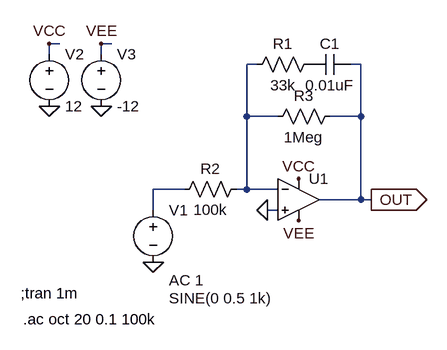
[diagram p0: schematic gaje_pink_noise_filter_01.asc]
gaje_pink_noise_filter_01.asc, the LTspice schematic file:
Version 4
SHEET 1 880 680
WIRE -80 -80 -96 -80
WIRE 0 -80 -16 -80
WIRE -96 -64 -96 -80
WIRE -16 -64 -16 -80
WIRE 224 -48 208 -48
WIRE 384 -48 368 -48
WIRE 208 32 208 -48
WIRE 256 32 208 32
WIRE 384 32 384 -48
WIRE 384 32 336 32
WIRE 112 144 64 144
WIRE 208 144 208 32
WIRE 208 144 192 144
WIRE 256 144 208 144
WIRE 384 160 384 32
WIRE 384 160 320 160
WIRE 400 160 384 160
WIRE 64 176 64 144
WIRE 256 176 240 176
FLAG 288 128 VCC
FLAG 288 192 VEE
FLAG 64 256 0
FLAG 240 176 0
FLAG -96 16 0
FLAG -16 16 0
FLAG -96 -80 VCC
FLAG -16 -80 VEE
FLAG 400 160 OUT
IOPIN 400 160 Out
SYMBOL Opamps\\UniversalOpamp2 288 160 R0
SYMATTR InstName U1
SYMBOL voltage 64 160 R0
WINDOW 3 24 152 Left 2
WINDOW 123 24 124 Left 2
WINDOW 39 0 0 Left 2
SYMATTR InstName V1
SYMATTR Value SINE(0 0.5 1k)
SYMATTR Value2 AC 1
SYMBOL res 320 -64 R90
WINDOW 0 0 56 VBottom 2
WINDOW 3 32 56 VTop 2
SYMATTR InstName R1
SYMATTR Value 33k
SYMBOL cap 368 -64 R90
WINDOW 0 0 32 VBottom 2
WINDOW 3 32 32 VTop 2
SYMATTR InstName C1
SYMATTR Value 0.01uF
SYMBOL voltage -96 -80 R0
WINDOW 123 0 0 Left 2
WINDOW 39 0 0 Left 2
SYMATTR InstName V2
SYMATTR Value 12
SYMBOL voltage -16 -80 R0
WINDOW 123 0 0 Left 2
WINDOW 39 0 0 Left 2
SYMATTR InstName V3
SYMATTR Value -12
SYMBOL res 208 128 R90
WINDOW 0 0 56 VBottom 2
WINDOW 3 32 56 VTop 2
SYMATTR InstName R2
SYMATTR Value 100k
SYMBOL res 352 16 R90
WINDOW 0 0 56 VBottom 2
WINDOW 3 32 56 VTop 2
SYMATTR InstName R3
SYMATTR Value 1Meg
TEXT -140 304 Left 2 !;tran 1m
TEXT -136 344 Left 2 !.ac oct 20 0.1 100k

The netlist it stands for:
* gaje_pink_noise_filter_01.asc
XU1 0 N001 VCC VEE OUT level.2 Avol=1Meg GBW=10Meg Slew=10Meg ilimit=25m rail=0 Vos=0 phimargin=45 en=0 enk=0 in=0 ink=0 Rin=500Meg  ; pins IN+ IN- V+ V- OUT
V1 N002 0 SINE(0 0.5 1k) AC 1
R1 P001 N001 33k
C1 OUT P001 0.01uF
V2 VCC 0 12
V3 VEE 0 -12
R2 N001 N002 100k
R3 OUT N001 1Meg
;tran 1m
.ac oct 20 0.1 100k
.lib UniversalOpamps2.sub
.backanno
.end